# EAGLE design dip28_a1 (EAGLE 5.11)
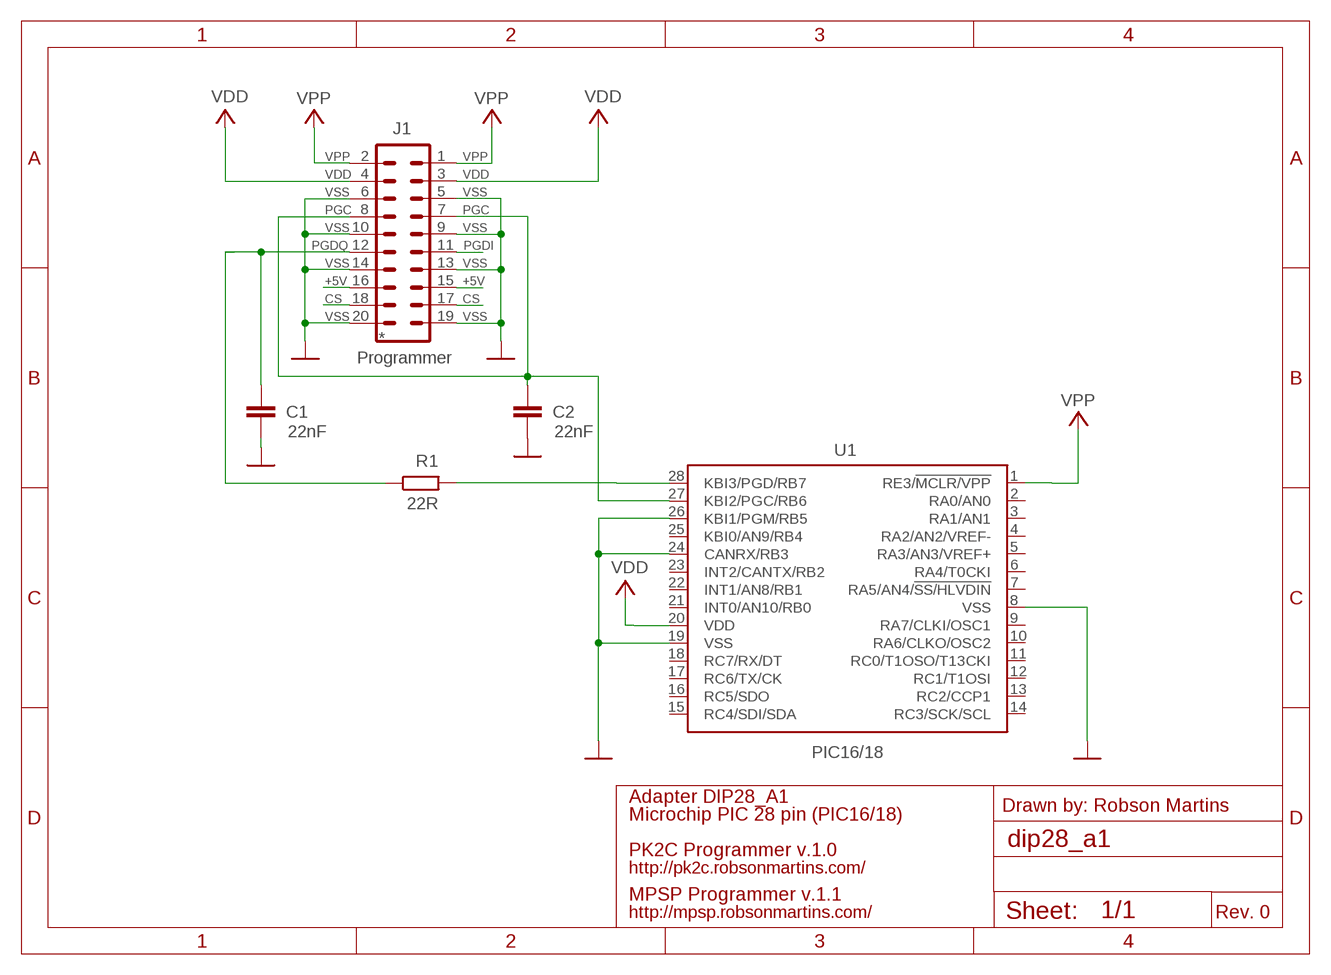
[diagram p0: schematic, sheet 1]

## Parts
C1  22nF  C-EU025-025X050  [C025-025X050]
C2  22nF  C-EU025-025X050  [C025-025X050]
J1  Programmer  MA10-2  [MA10-2]
R1  22R  R-EU_0204/7  [0204/7]
U1  PIC16/18  PIC18F2480-I/SP  [DIL28-3]

## Nets
+5V: J1.15 J1.16
CS: J1.17 J1.18
GND: C1.2 C2.2 J1.5 J1.6 J1.9 J1.10 J1.13 J1.14 J1.19 J1.20 U1.8(VSS) U1.19(VSS) U1.24(CANRX/RB3) U1.26(KBI1/PGM/RB5)
PGC: C2.1 J1.7 J1.8 U1.27(KBI2/PGC/RB6)
PGD: C1.1 J1.12 R1.1
PGD_CHIP: R1.2 U1.28(KBI3/PGD/RB7)
PGDI: J1.11
VDD: J1.3 J1.4 U1.20(VDD)
VPP: J1.1 J1.2 U1.1(RE3/!MCLR/VPP)
Unconnected: U1.2(RA0/AN0) U1.3(RA1/AN1) U1.4(RA2/AN2/VREF-) U1.5(RA3/AN3/VREF+) U1.6(RA4/T0CKI) U1.7(RA5/AN4/!SS/HLVDIN) U1.9(RA7/CLKI/OSC1) U1.10(RA6/CLKO/OSC2) U1.11(RC0/T1OSO/T13CKI) U1.12(RC1/T1OSI) U1.13(RC2/CCP1) U1.14(RC3/SCK/SCL) U1.15(RC4/SDI/SDA) U1.16(RC5/SDO) U1.17(RC6/TX/CK) U1.18(RC7/RX/DT) U1.21(INT0/AN10/RB0) U1.22(INT1/AN8/RB1) U1.23(INT2/CANTX/RB2) U1.25(KBI0/AN9/RB4)

## Notes on the sheet
- VPP | VPP
- VDD | VDD
- VSS | VSS
- PGC | PGC
- VSS | VSS
- PGDQ | PGDI
- VSS | VSS
- +5V | +5V
- CS | CS
- VSS | VSS
- *
- Adapter DIP28_A1
- Drawn by: Robson Martins
- Microchip PIC 28 pin (PIC16/18)
- PK2C Programmer v.1.0
- http://pk2c.robsonmartins.com/
- MPSP Programmer v.1.1
- http://mpsp.robsonmartins.com/ | Rev. 0

## Library data of the parts
C1 C2 = rcl:C-EU: CAPACITOR, European symbol
J1 = con-lstb:MA10-2: PIN HEADER; OC_FARNELL: unknown; OC_NEWARK: unknown
R1 = resistor:R-EU_: RESISTOR, European symbol
U1 = microchip:PIC18F2*80: 28-Pin Enhanced Flash Microcontrollers with ECAN(TM) Technology 10-Bit A/D and nanoWatt Technology Source: http://www.microchip.com .. 39637a.pdf; MF: MICROCHIP; MPN: PIC18F2480-I/SP; OC_FARNELL: 9321217; OC_NEWARK: 71J7237

## Board
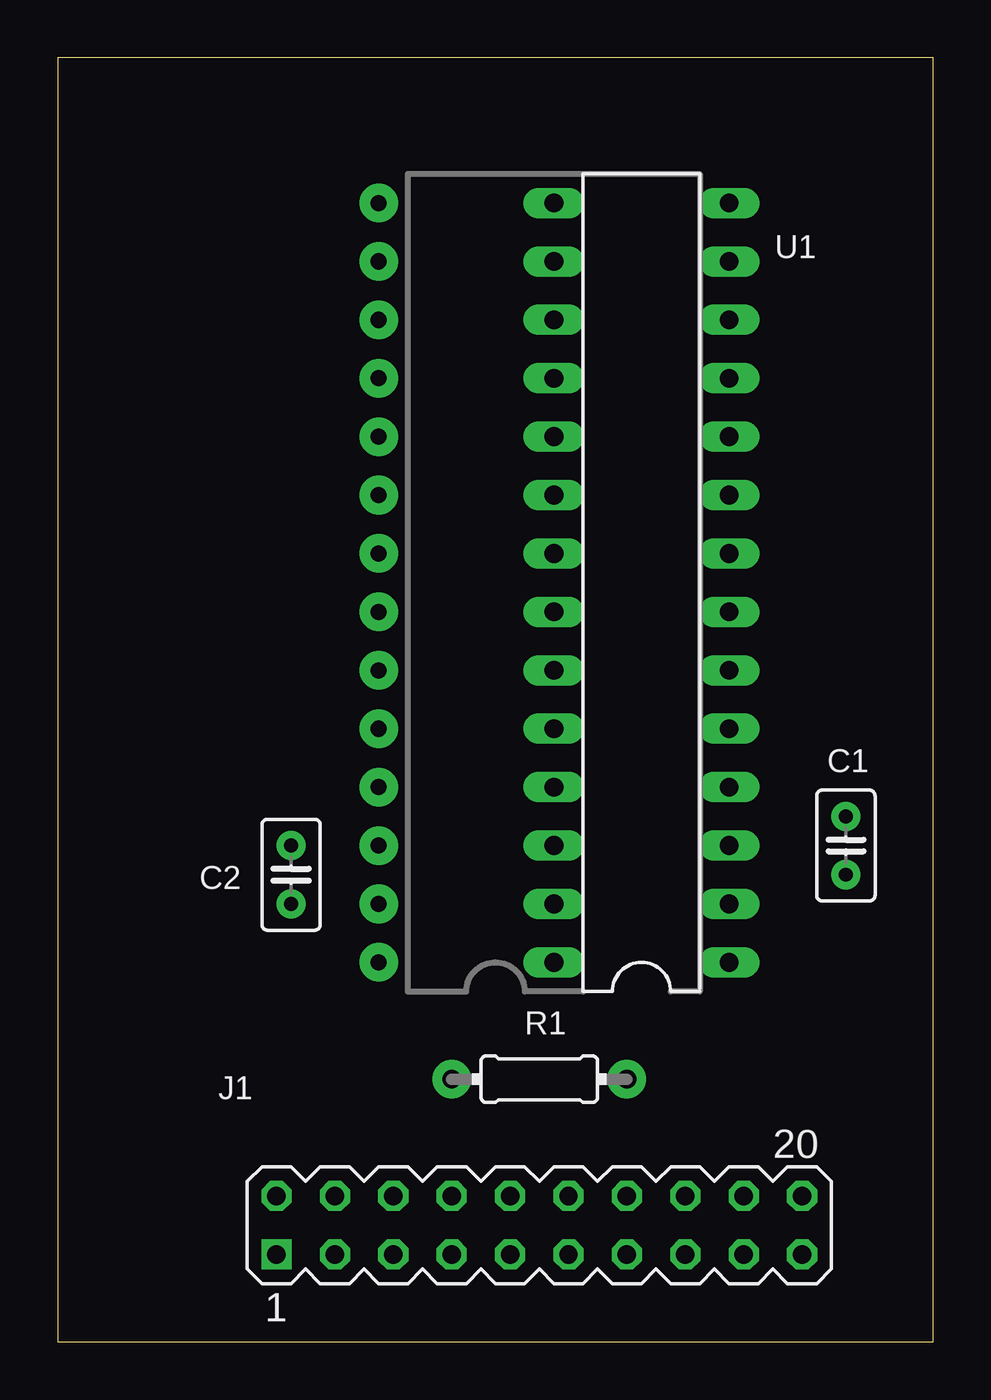
[diagram p1: board, top side]
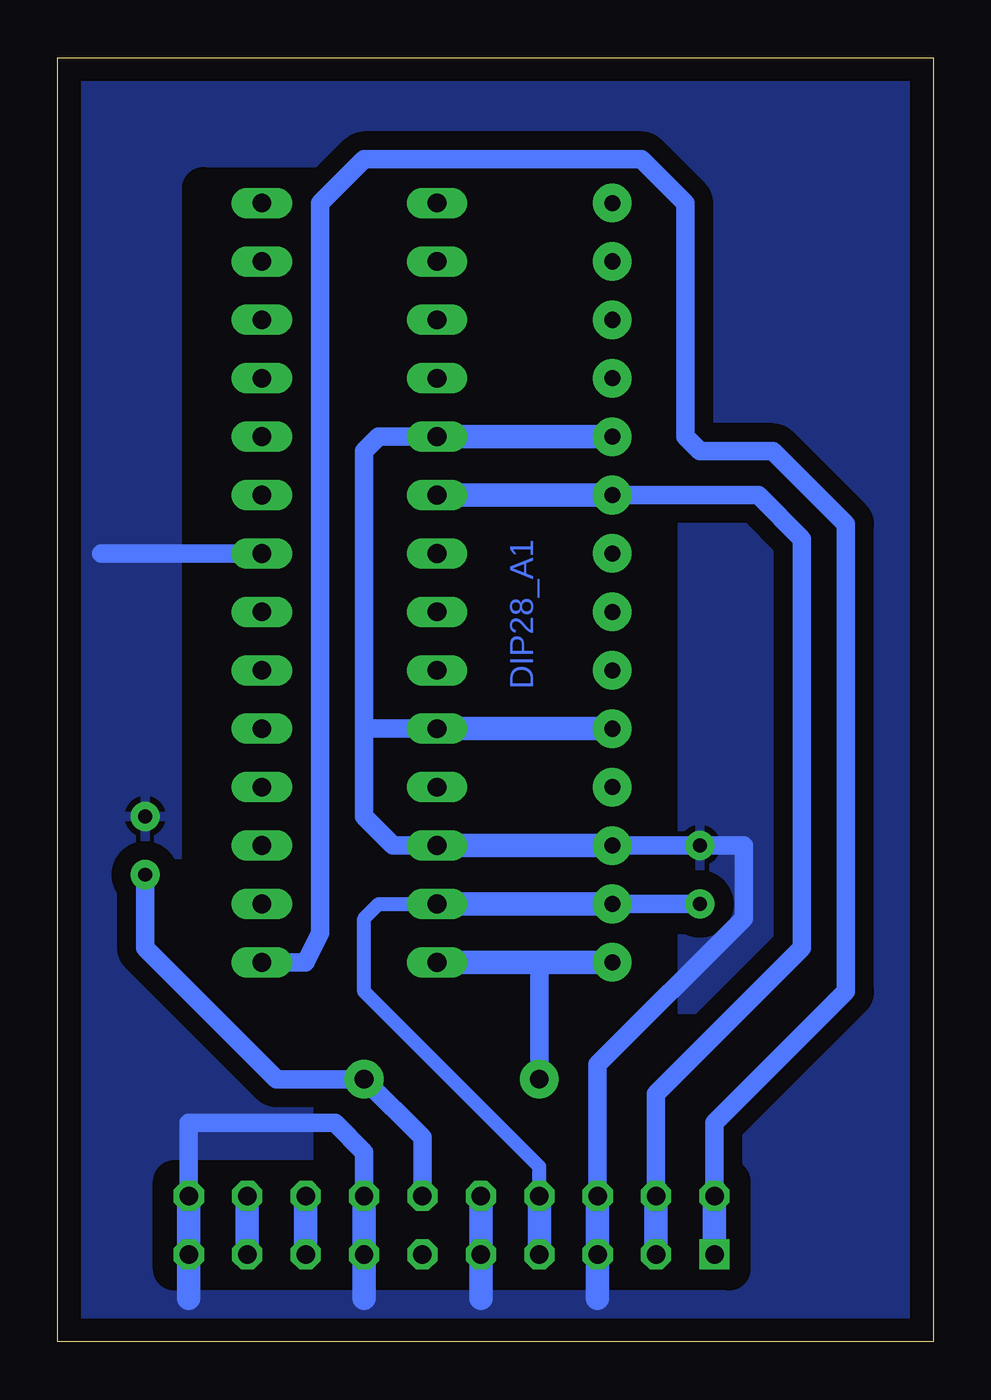
[diagram p2: board, bottom side, seen from below]

Size 38.1 x 55.86 mm. Coordinates in mm from the lower left corner, seen from the top.
Outline: 38.1,0 38.1,55.86 0,55.86 0,0 38.1,0
Copper layers (1*16): Top 0.035mm / dielectric 1.5mm / Bottom 0.035mm
Design rules "default": minimum track width 10mil, minimum drill 24mil, track to track 8mil, track to pad 8mil, pad to pad 8mil, via to via 8mil, smd to smd 8mil, copper to edge 40mil, drill to drill 8mil, minimum pad ring 10mil, minimum via ring 8mil, stop-mask expansion 4mil, vias tented up to drill 0mil, thermal gap 10mil
bRestrict: area 8.9,3.2 to 33,13.3; area 12.1,13.3 to 31.8,50.2

### Footprints (pad centres in the part's own frame; a part is rotated, then mirrored left to right if it is on the bottom)
C025-025X050 = drill 0.6 pad 1.27 round: 1 -1.27,0; 2 1.27,0
MA10-2 = drill 0.8 pad 1.27 square: 1 -11.43,-1.27 | drill 0.8 pad 1.27 octagon: 2 -11.43,1.27; 3 -8.89,-1.27; 4 -8.89,1.27; 5 -6.35,-1.27; 6 -6.35,1.27; 7 -3.81,-1.27; 8 -3.81,1.27; 9 -1.27,-1.27; 10 -1.27,1.27; 11 1.27,-1.27; 12 1.27,1.27; 13 3.81,-1.27; 14 3.81,1.27; 15 6.35,-1.27; 16 6.35,1.27; 17 8.89,-1.27; 18 8.89,1.27; 19 11.43,-1.27; 20 11.43,1.27
0204/7 = drill 0.813 pad 1.676 round: 1 -3.81,0 | drill 0.8 pad 1.676 round: 2 3.81,0
DIL28-3 = drill 0.813 long: 1 -16.51,-3.81; 2 -13.97,-3.81; 3 -11.43,-3.81; 4 -8.89,-3.81; 5 -6.35,-3.81; 6 -3.81,-3.81; 7 -1.27,-3.81; 8 1.27,-3.81; 9 3.81,-3.81; 10 6.35,-3.81; 11 8.89,-3.81; 12 11.43,-3.81; 13 13.97,-3.81; 14 16.51,-3.81; 15 16.51,3.81; 16 13.97,3.81; 17 11.43,3.81; 18 8.89,3.81; 19 6.35,3.81; 20 3.81,3.81; 21 1.27,3.81; 22 -1.27,3.81; 23 -3.81,3.81; 24 -6.35,3.81; 25 -8.89,3.81; 26 -11.43,3.81; 27 -13.97,3.81; 28 -16.51,3.81

### Placement (x,y rotation side)
C1  34.29,21.59 90 top
C2  10.16,20.32 90 top
J1  20.96,5.08 0 top
R1  20.96,11.43 180 top
U1  25.4,33.02 90 top

### Tracks (layer width: path | path; a pad name or v marks a point on that pad's centre or on a via)
+5V
  Bottom 1.016: J1.15 J1.16
CS
  Bottom 1.016: J1.17 J1.18
GND  (via drill 0.7 pad 1.68)
  Bottom 0.813: J1.14 24.77,8.26 26.04,9.53 32.39,9.53 J1.20 | J1.6 14.61,8.89 14.61,9.53 14.61,12.06 8.26,18.41 8.26,21.59 v13.97,21.59 C2.2 | U1.26 23.5,21.59 24.77,22.86 24.77,26.67 | 24.77,26.67 24.77,38.73 24.13,39.37 U1.19 | 24.77,26.67 U1.24 | U1.8 36.2,34.29
  Bottom 1.016: J1.6 J1.5 14.61,1.91 | J1.10 J1.9 19.69,1.91 | J1.14 J1.13 24.77,1.91 | J1.20 J1.19 32.39,1.91 | U1.19 v13.97,39.37 | U1.24 v13.97,26.67 | v13.97,21.59 U1.26
  pour Bottom (isolate 0.813): 38.1,0 0,0 0,55.88 38.1,55.88
N$4  (via drill 0.7 pad 1.68)
  other vias: 13.97,24.13
N$6  (via drill 0.7 pad 1.68)
  other vias: 13.97,29.21
N$7  (via drill 0.7 pad 1.68)
  other vias: 13.97,31.75
N$8  (via drill 0.7 pad 1.68)
  other vias: 13.97,34.29
N$11  (via drill 0.7 pad 1.68)
  other vias: 13.97,41.91
N$12  (via drill 0.7 pad 1.68)
  other vias: 13.97,44.45
N$13  (via drill 0.7 pad 1.68)
  other vias: 13.97,46.99
N$14  (via drill 0.7 pad 1.68)
  other vias: 13.97,49.53
PGC  (via drill 0.7 pad 1.68)
  Bottom 0.61: J1.8 17.15,7.62 21.59,12.06 24.77,15.24 24.77,18.41 24.13,19.05 U1.27
  Bottom 0.813: v13.97,19.05 C2.1
  Bottom 1.016: J1.7 J1.8 | U1.27 v13.97,19.05
PGD
  Bottom 0.813: J1.12 22.23,8.89 R1.1 28.58,11.43 34.29,17.14 C1.1
PGD_CHIP  (via drill 0.7 pad 1.68)
  Bottom 0.813: R1.2 17.15,16.51
  Bottom 1.016: v13.97,16.51 17.15,16.51 U1.28
VDD  (via drill 0.7 pad 1.68)
  Bottom 0.813: J1.4 12.07,7.62 12.07,8.89 12.07,10.79 5.72,17.14 5.72,34.92 7.62,36.83 v13.97,36.83
  Bottom 1.016: J1.3 J1.4 | v13.97,36.83 U1.20
VPP
  Bottom 0.813: J1.1 9.53,7.62 9.53,9.53 3.81,15.24 3.81,35.56 6.99,38.73 10.16,38.73 10.8,39.37 10.8,43.18 10.8,49.53 12.7,51.44 24.77,51.44 26.67,49.53 26.67,17.78 27.31,16.51 U1.1
  Bottom 1.016: J1.1 J1.2

### Text on the board
Bottom: DIP28_A1
tDocu: Microchip PIC | PIC 16/18 | DIP28_A1 | Adapter | VSS | VPP | VDD | VSS | PGC | VSS | PGD | VSS | +5V | CS